# EasyEDA schematic SCH_fightpad_2024-06-18.json
TITLE: Sheet_1; REV: 1.0; Date: 2024-06-17; Sheet: 1/1; Drawn By: elberto22; Company: Your Company
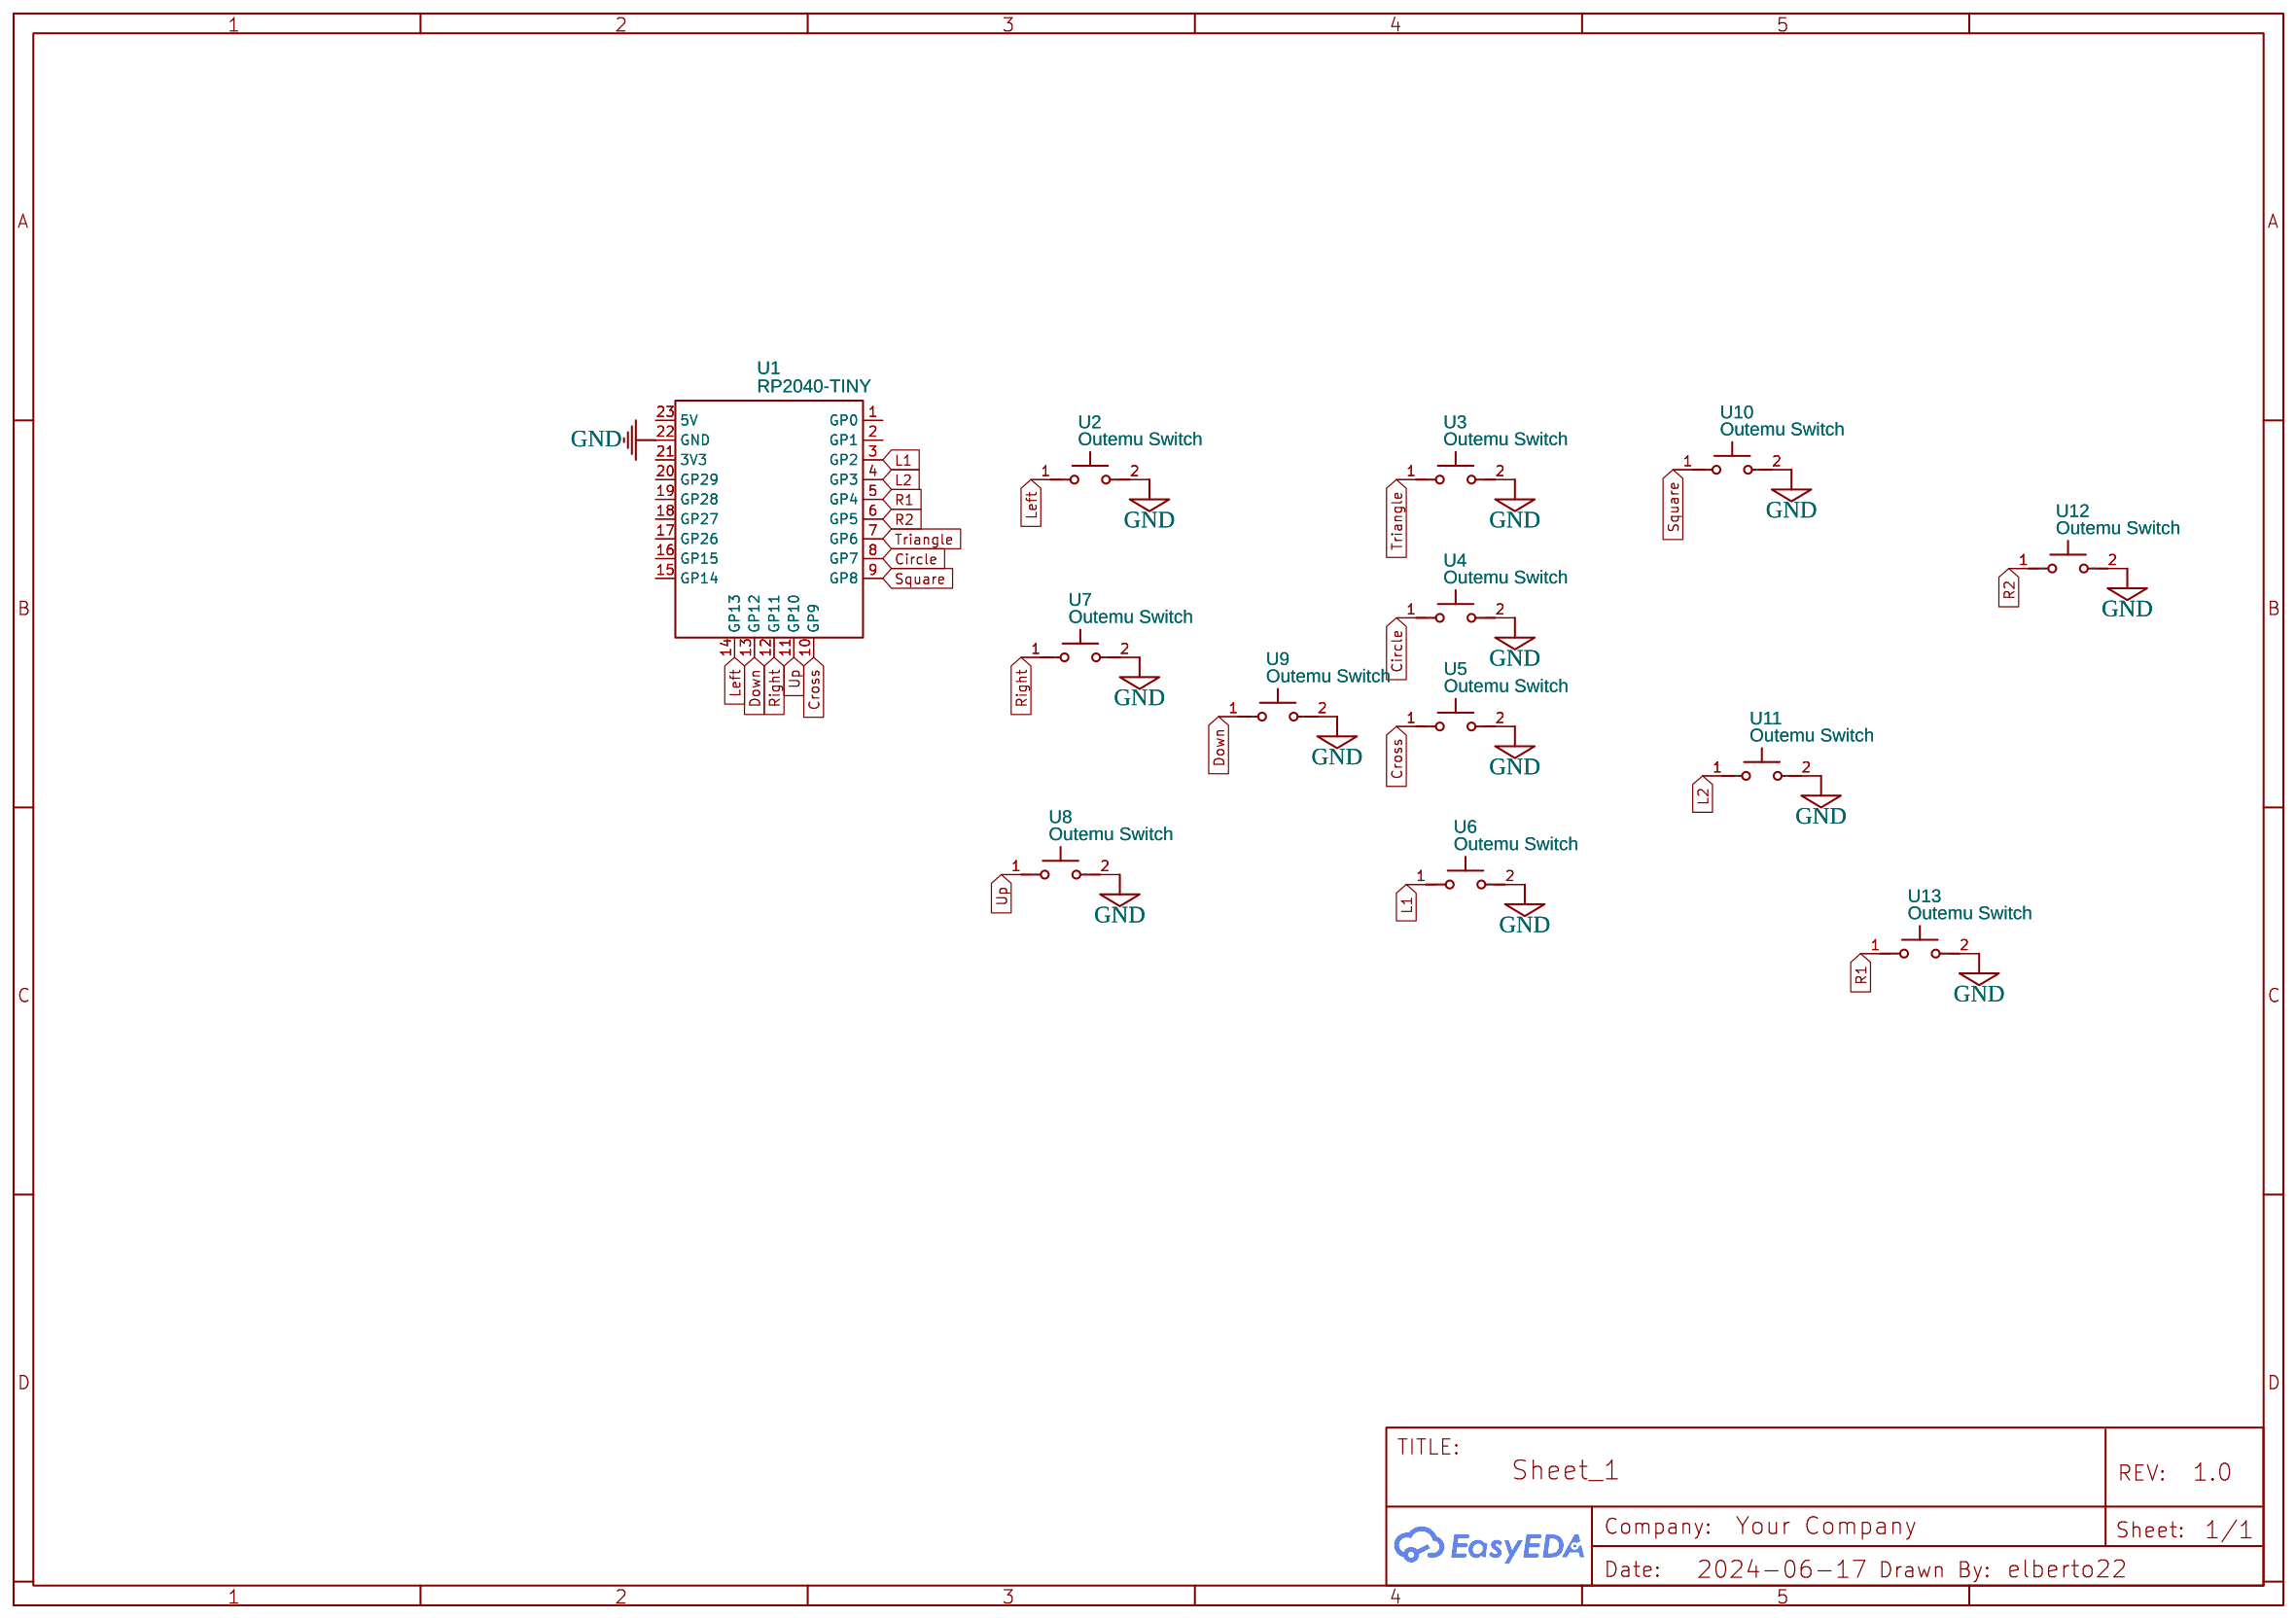
[diagram p0: schematic sheet]

## Parts
U1  RP2040-TINY  [COMM-SMD_23P-P2.54-L23.5-W18.0_RP2040-TINY]
U2  Outemu Switch  [OUTEMU SWITCH]
U3  Outemu Switch  [OUTEMU SWITCH]
U4  Outemu Switch  [OUTEMU SWITCH]
U5  Outemu Switch  [OUTEMU SWITCH]
U6  Outemu Switch  [OUTEMU SWITCH]
U7  Outemu Switch  [OUTEMU SWITCH]
U8  Outemu Switch  [OUTEMU SWITCH]
U9  Outemu Switch  [OUTEMU SWITCH]
U10  Outemu Switch  [OUTEMU SWITCH]
U11  Outemu Switch  [OUTEMU SWITCH]
U12  Outemu Switch  [OUTEMU SWITCH]
U13  Outemu Switch  [OUTEMU SWITCH]

## Library data of the parts
U1 = RP2040-TINY: Supplier: LCSC; Supplier Part: C7437606; Manufacturer: Waveshare(微雪电子); Manufacturer Part: RP2040-Tiny; Contributor: lcsc
U2-U13 = Outemu Switch: Manufacturer: HepLer; Supplier: Others; Contributor: QUEBO MTB

## Nets
GND: U1.22(GND) U2.2 U3.2 U4.2 U5.2 U6.2 U7.2 U8.2 U9.2 U10.2 U11.2 U12.2 U13.2
Circle: U1.8(GP7) U4.1
Cross: U1.10(GP9) U5.1
Down: U1.13(GP12) U9.1
L1: U1.3(GP2) U6.1
L2: U1.4(GP3) U11.1
Left: U1.14(GP13) U2.1
R1: U1.5(GP4) U13.1
R2: U1.6(GP5) U12.1
Right: U1.12(GP11) U7.1
Square: U1.9(GP8) U10.1
Triangle: U1.7(GP6) U3.1
Up: U1.11(GP10) U8.1

Not connected (* = marked no-connect by the designer): U1 1(GP0) 2(GP1) 15(GP14) 16(GP15) 17(GP26) 18(GP27) 19(GP28) 20(GP29) 21(3V3) 23(5V)
